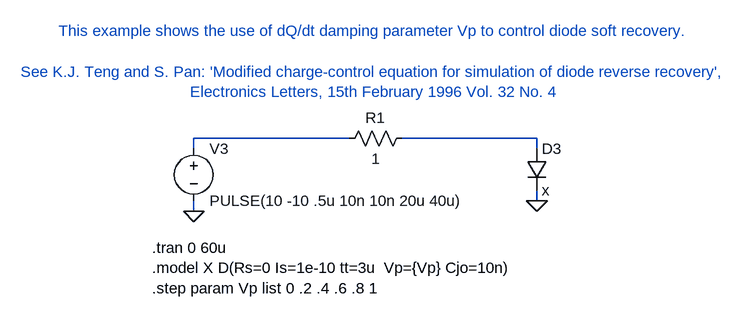
[diagram p0: schematic SoftDiodeRecovery.asc]
SoftDiodeRecovery.asc, the LTspice schematic file:
Version 4
SHEET 1 1796 1732
WIRE -496 832 -736 832
WIRE -208 832 -416 832
WIRE -736 848 -736 832
WIRE -208 848 -208 832
WIRE -208 928 -208 912
WIRE -736 944 -736 928
FLAG -736 944 0
FLAG -208 928 0
SYMBOL voltage -736 832 R0
WINDOW 123 24 138 Left 2
WINDOW 39 24 117 Left 2
SYMATTR InstName V3
SYMATTR Value PULSE(10 -10 .5u 10n 10n 20u 40u)
SYMBOL diode -224 848 R0
SYMATTR InstName D3
SYMATTR Value x
SYMBOL res -512 848 R270
WINDOW 0 32 56 VTop 2
WINDOW 3 0 56 VBottom 2
SYMATTR InstName R1
SYMATTR Value 1
TEXT -800 1000 Left 2 !.tran 0 60u\n.model X D(Rs=0 Is=1e-10 tt=3u  Vp={Vp} Cjo=10n)\n.step param Vp list 0 .2 .4 .6 .8 1
TEXT -456 776 Bottom 2 ;This example shows the use of dQ/dt damping parameter Vp to control diode soft recovery.\n \nSee K.J. Teng and S. Pan: 'Modified charge-control equation for simulation of diode reverse recovery',\nElectronics Letters, 15th February 1996 Vol. 32 No. 4

The netlist it stands for:
* SoftDiodeRecovery.asc
V3 N001 0 PULSE(10 -10 .5u 10n 10n 20u 40u)
D3 N002 0 x
R1 N001 N002 1
.model D D
.lib standard.dio
.tran 0 60u
.model X D(Rs=0 Is=1e-10 tt=3u  Vp={Vp} Cjo=10n)
.step param Vp list 0 .2 .4 .6 .8 1
* This example shows the use of dQ/dt damping parameter Vp to control diode soft recovery.
* See K.J. Teng and S. Pan: 'Modified charge-control equation for simulation of diode reverse recovery',
* Electronics Letters, 15th February 1996 Vol. 32 No. 4
.backanno
.end